# Altium schematic sheet breakout.SchDoc
size A
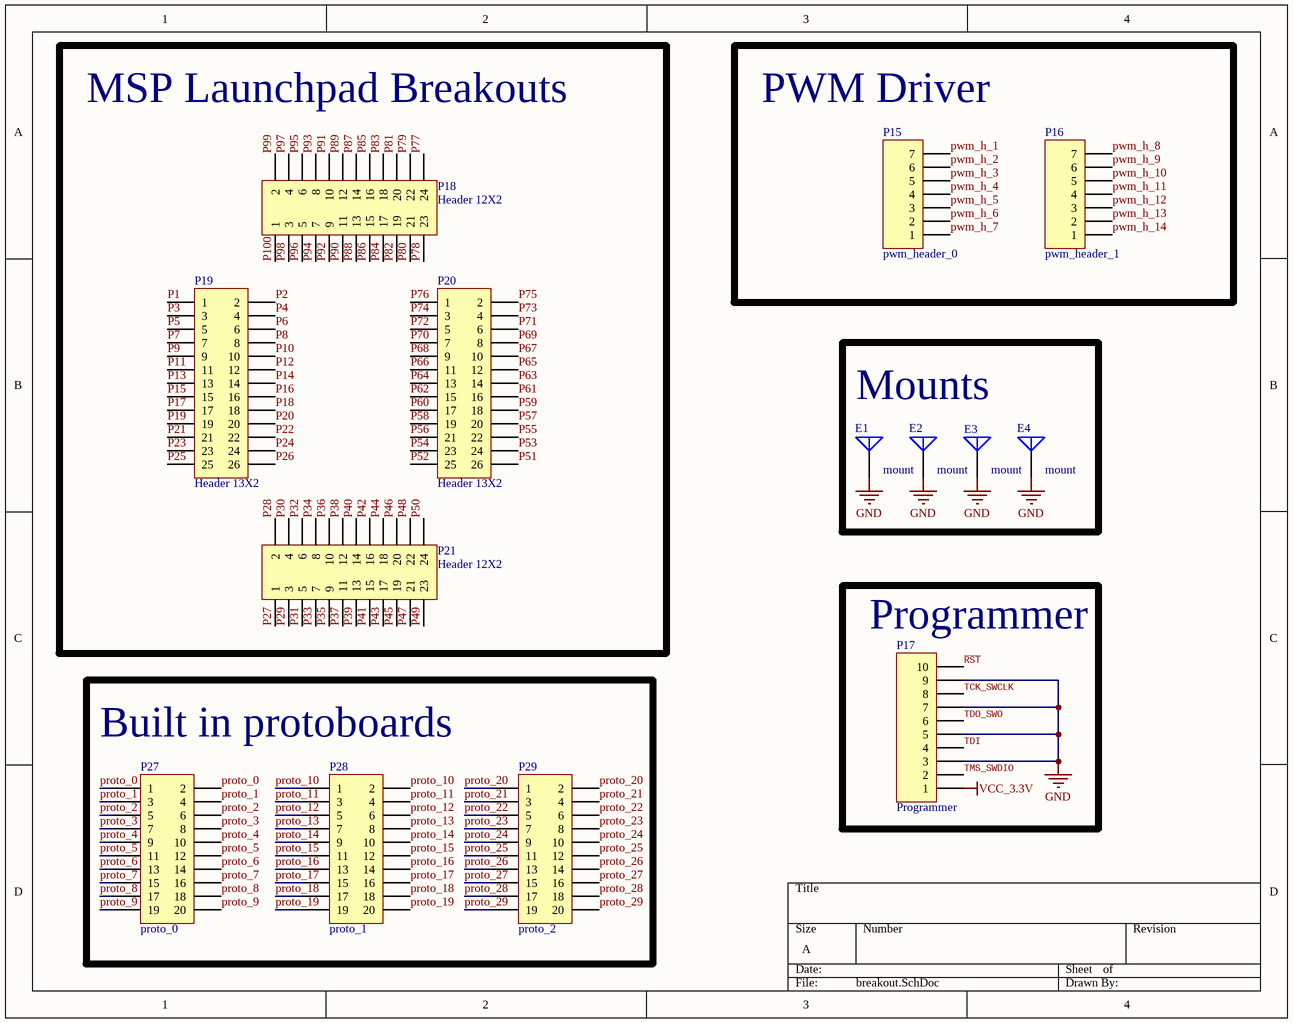
[diagram p0: breakout.SchDoc]

## Parts
E1  mount  [PIN1]
E2  mount  [PIN1]
E3  mount  [PIN1]
E4  mount  [PIN1]
P15  pwm_header_0  [HDR1X7]
P16  pwm_header_1  [HDR1X7]
P17  Programmer  [HDR1X10]
P18  Header 12X2  [HDR2X12]
P19  Header 13X2  [HDR2X13]
P20  Header 13X2  [HDR2X13]
P21  Header 12X2  [HDR2X12]
P27  proto_0  [HDR2X10]
P28  proto_1  [HDR2X10]
P29  proto_2  [HDR2X10]

## Blocks framed on the sheet
MSP Launchpad Breakouts: P18-P21
PWM Driver: P15 P16
Mounts: E1-E4
Programmer: P17
Built in protoboards: P27-P29

## Nets
GND: E1.1(A) E2.1(A) E3.1(A) E4.1(A) P17.3 P17.5 P17.7 P17.9
VCC_3.3V: P17.1
P1: P19.1
P2: P19.2
P3: P19.3
P4: P19.4
P5: P19.5
P6: P19.6
P7: P19.7
P8: P19.8
P9: P19.9
P10: P19.10
P11: P19.11
P12: P19.12
P13: P19.13
P14: P19.14
P15: P19.15
P16: P19.16
P17: P19.17
P18: P19.18
P19: P19.19
P20: P19.20
P21: P19.21
P22: P19.22
P23: P19.23
P24: P19.24
P25: P19.25
P26: P19.26
P27: P21.1
P28: P21.2
P29: P21.3
P30: P21.4
P31: P21.5
P32: P21.6
P33: P21.7
P34: P21.8
P35: P21.9
P36: P21.10
P37: P21.11
P38: P21.12
P39: P21.13
P40: P21.14
P41: P21.15
P42: P21.16
P43: P21.17
P44: P21.18
P45: P21.19
P46: P21.20
P47: P21.21
P48: P21.22
P49: P21.23
P50: P21.24
P51: P20.26
P52: P20.25
P53: P20.24
P54: P20.23
P55: P20.22
P56: P20.21
P57: P20.20
P58: P20.19
P59: P20.18
P60: P20.17
P61: P20.16
P62: P20.15
P63: P20.14
P64: P20.13
P65: P20.12
P66: P20.11
P67: P20.10
P68: P20.9
P69: P20.8
P70: P20.7
P71: P20.6
P72: P20.5
P73: P20.4
P74: P20.3
P75: P20.2
P76: P20.1
P77: P18.24
P78: P18.23
P79: P18.22
P80: P18.21
P81: P18.20
P82: P18.19
P83: P18.18
P84: P18.17
P85: P18.16
P86: P18.15
P87: P18.14
P88: P18.13
P89: P18.12
P90: P18.11
P91: P18.10
P92: P18.9
P93: P18.8
P94: P18.7
P95: P18.6
P96: P18.5
P97: P18.4
P98: P18.3
P99: P18.2
P100: P18.1
proto_0: P27.1 P27.2
proto_1: P27.3 P27.4
proto_2: P27.5 P27.6
proto_3: P27.7 P27.8
proto_4: P27.9 P27.10
proto_5: P27.11 P27.12
proto_6: P27.13 P27.14
proto_7: P27.15 P27.16
proto_8: P27.17 P27.18
proto_9: P27.19 P27.20
proto_10: P28.1 P28.2
proto_11: P28.3 P28.4
proto_12: P28.5 P28.6
proto_13: P28.7 P28.8
proto_14: P28.9 P28.10
proto_15: P28.11 P28.12
proto_16: P28.13 P28.14
proto_17: P28.15 P28.16
proto_18: P28.17 P28.18
proto_19: P28.19 P28.20
proto_20: P29.1 P29.2
proto_21: P29.3 P29.4
proto_22: P29.5 P29.6
proto_23: P29.7 P29.8
proto_24: P29.9 P29.10
proto_25: P29.11 P29.12
proto_26: P29.13 P29.14
proto_27: P29.15 P29.16
proto_28: P29.17 P29.18
proto_29: P29.19 P29.20
pwm_h_1: P15.7
pwm_h_2: P15.6
pwm_h_3: P15.5
pwm_h_4: P15.4
pwm_h_5: P15.3
pwm_h_6: P15.2
pwm_h_7: P15.1
pwm_h_8: P16.7
pwm_h_9: P16.6
pwm_h_10: P16.5
pwm_h_11: P16.4
pwm_h_12: P16.3
pwm_h_13: P16.2
pwm_h_14: P16.1
~{RST}: P17.10
TCK_SWCLK: P17.8
TDI: P17.4
TDO_SWO: P17.6
TMS_SWDIO: P17.2

## Library data of the parts
E1-E4 = Antenna: Generic Antenna; Published: 24-Mar-1999; LatestRevisionDate: 17-Jul-2002; LatestRevisionNote: Re-released for DXP Platform.; PackageReference: PIN1; Publisher: Altium Limited
P15 P16 = Header 7: Header, 7-Pin; LatestRevisionDate: 17-Jul-2002; LatestRevisionNote: Re-released for DXP Platform.; Publisher: Altium Limited
P17 = Header 10: Header, 10-Pin; LatestRevisionDate: 17-Jul-2002; LatestRevisionNote: Re-released for DXP Platform.; Publisher: Altium Limited
P18 P21 = Header 12X2: Header, 12-Pin, Dual row; LatestRevisionDate: 17-Jul-2002; LatestRevisionNote: Re-released for DXP Platform.; Publisher: Altium Limited
P19 P20 = Header 13X2: Header, 13-Pin, Dual row; LatestRevisionDate: 17-Jul-2002; LatestRevisionNote: Re-released for DXP Platform.; Publisher: Altium Limited
P27-P29 = Header 10X2: Header, 10-Pin, Dual row; LatestRevisionDate: 17-Jul-2002; LatestRevisionNote: Re-released for DXP Platform.; Publisher: Altium Limited